# Altium schematic sheet 1.3.0_Power_board.SchDoc
size A4; DocumentNumber: 11; SheetNumber: 11; SheetTotal: 14
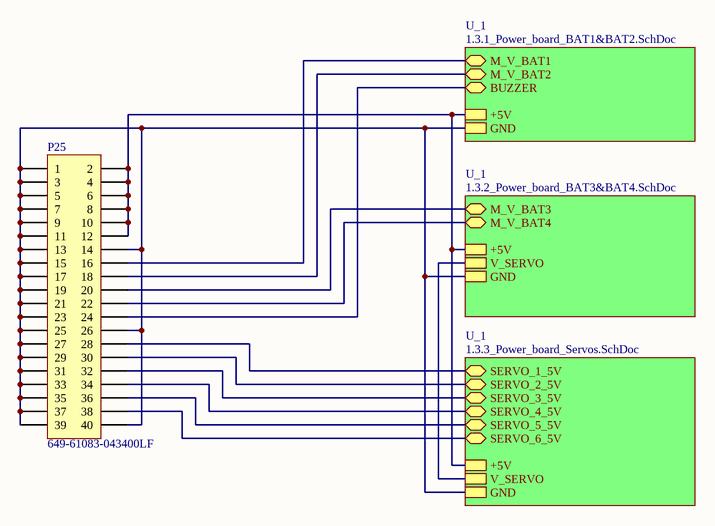
[diagram p0: 1.3.0_Power_board.SchDoc]

## Parts
P25  Supplier Part Number 1: 649-61083-043400LF  [61083-043400LF]  (hidden comment: 61083-043400LF)

## Sub-sheets
U_1 = 1.3.3_Power_board_Servos.SchDoc: SERVO_1_5V (bidir), SERVO_2_5V (bidir), SERVO_3_5V (bidir), SERVO_4_5V (bidir), SERVO_5_5V (bidir), SERVO_6_5V (bidir), GND, +5V, V_SERVO
U_1 = 1.3.1_Power_board_BAT1&BAT2.SchDoc: BUZZER (bidir), M_V_BAT1 (bidir), M_V_BAT2 (bidir), GND, +5V
U_1 = 1.3.2_Power_board_BAT3&BAT4.SchDoc: M_V_BAT3 (bidir), GND, +5V, M_V_BAT4 (bidir), V_SERVO

## Nets
NetP25_1: P25.1 P25.3 P25.5 P25.7 P25.9 P25.11 P25.13 P25.14 P25.15 P25.17 P25.19 P25.21 P25.23 P25.25 P25.26 P25.27 P25.29 P25.31 P25.33 P25.35 P25.37 P25.39 P25.40 ; sheet U_1/GND, sheet U_1/GND, sheet U_1/GND
NetP25_2: P25.2 P25.4 P25.6 P25.8 P25.10 P25.12 ; sheet U_1/+5V, sheet U_1/+5V, sheet U_1/+5V
NetP25_16: P25.16 ; sheet U_1/M_V_BAT1
NetP25_18: P25.18 ; sheet U_1/M_V_BAT2
NetP25_20: P25.20 ; sheet U_1/M_V_BAT3
NetP25_22: P25.22 ; sheet U_1/M_V_BAT4
NetP25_24: P25.24 ; sheet U_1/BUZZER
NetP25_28: P25.28 ; sheet U_1/SERVO_1_5V
NetP25_30: P25.30 ; sheet U_1/SERVO_2_5V
NetP25_32: P25.32 ; sheet U_1/SERVO_3_5V
NetP25_34: P25.34 ; sheet U_1/SERVO_4_5V
NetP25_36: P25.36 ; sheet U_1/SERVO_5_5V
NetP25_38: P25.38 ; sheet U_1/SERVO_6_5V
(unnamed): sheet U_1/V_SERVO, sheet U_1/V_SERVO

## Library data of the parts
P25 = 61083-043400LF: Connecteurs carte à carte et mezzanine PLUG 40P; Supplier 1: Mouser